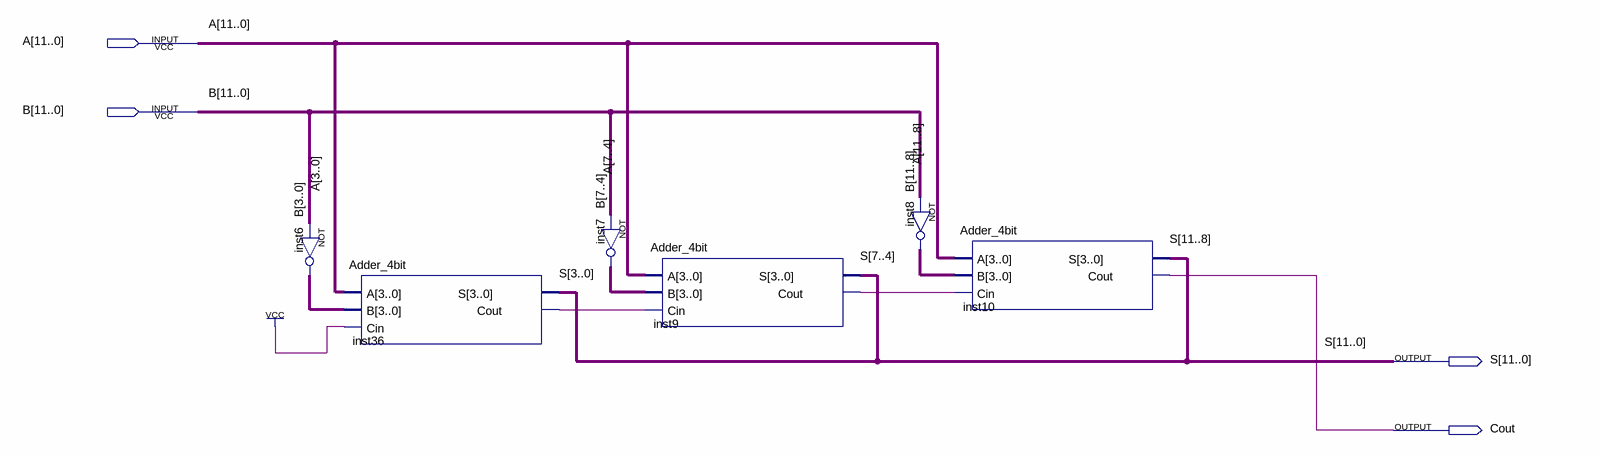
[diagram p0: schematic sheet]
// Quartus schematic Sub_12bit.bdf as structural Verilog: 6 symbols, 4 pins
module Sub_12bit (
  input  [11:0] A,
  input  [11:0] B,
  output [11:0] S,
  output Cout
);

  wire inst9_cout, inst36_cout;
  wire [3:0] inst6_out, inst7_out, inst8_out;

  assign inst6_out = ~B[3:0];  // NOT inst6, 4 bits wide
  Adder_4bit inst36 (.A(A[3:0]), .B(inst6_out), .Cin(1'b1), .S(S[3:0]), .Cout(inst36_cout));
  assign inst7_out = ~B[7:4];  // NOT inst7, 4 bits wide
  Adder_4bit inst9 (.A(A[7:4]), .B(inst7_out), .Cin(inst36_cout), .S(S[7:4]), .Cout(inst9_cout));
  assign inst8_out = ~B[11:8];  // NOT inst8, 4 bits wide
  Adder_4bit inst10 (.A(A[11:8]), .B(inst8_out), .Cin(inst9_cout), .S(S[11:8]), .Cout(Cout));
endmodule
